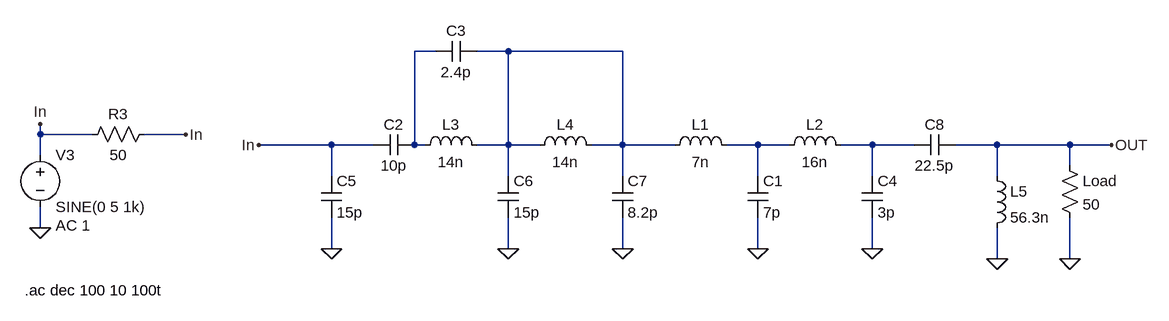
[diagram p0: schematic 433MHz filter with added low pass_and increased high pass.asc]
433MHz filter with added low pass_and increased high pass.asc, the LTspice schematic file:
Version 4
SHEET 1 2444 680
WIRE -944 16 -976 16
WIRE -832 16 -880 16
WIRE -656 16 -832 16
WIRE -1552 144 -1552 128
WIRE -1472 144 -1552 144
WIRE -1328 144 -1392 144
WIRE -1104 160 -1216 160
WIRE -1040 160 -1104 160
WIRE -976 160 -976 16
WIRE -960 160 -976 160
WIRE -832 160 -832 16
WIRE -832 160 -880 160
WIRE -784 160 -832 160
WIRE -656 160 -656 16
WIRE -656 160 -704 160
WIRE -576 160 -656 160
WIRE -448 160 -496 160
WIRE -400 160 -448 160
WIRE -272 160 -320 160
WIRE -208 160 -272 160
WIRE -80 160 -144 160
WIRE 32 160 -80 160
WIRE 96 160 32 160
WIRE -1552 176 -1552 144
WIRE 32 192 32 160
WIRE -1104 208 -1104 160
WIRE -832 208 -832 160
WIRE -656 208 -656 160
WIRE -448 208 -448 160
WIRE -272 208 -272 160
WIRE -80 208 -80 160
WIRE -1552 288 -1552 256
WIRE -1104 320 -1104 272
WIRE -832 320 -832 272
WIRE -656 320 -656 272
WIRE -448 320 -448 272
WIRE -272 320 -272 272
WIRE -80 336 -80 288
WIRE 32 336 32 272
FLAG -832 320 0
FLAG 32 336 0
FLAG -1552 288 0
FLAG -1552 128 In
FLAG -1328 144 In
FLAG 96 160 OUT
FLAG -272 320 0
FLAG -448 320 0
FLAG -80 336 0
FLAG -1216 160 In
FLAG -656 320 0
FLAG -1104 320 0
SYMBOL ind -976 176 R270
WINDOW 0 32 56 VTop 2
WINDOW 3 5 56 VBottom 2
SYMATTR InstName L3
SYMATTR Value 14n
SYMBOL ind -800 176 R270
WINDOW 0 32 56 VTop 2
WINDOW 3 5 56 VBottom 2
SYMATTR InstName L4
SYMATTR Value 14n
SYMBOL cap -1120 208 R0
SYMATTR InstName C5
SYMATTR Value 15p
SYMBOL cap -848 208 R0
SYMATTR InstName C6
SYMATTR Value 15p
SYMBOL cap -672 208 R0
SYMATTR InstName C7
SYMATTR Value 8.2p
SYMBOL cap -1040 176 R270
WINDOW 0 32 32 VTop 2
WINDOW 3 0 32 VBottom 2
SYMATTR InstName C2
SYMATTR Value 10p
SYMBOL cap -944 32 R270
WINDOW 0 32 32 VTop 2
WINDOW 3 0 32 VBottom 2
SYMATTR InstName C3
SYMATTR Value 2.4p
SYMBOL res 16 176 R0
SYMATTR InstName Load
SYMATTR Value 50
SYMBOL voltage -1552 160 R0
WINDOW 123 24 124 Left 2
WINDOW 39 0 0 Left 2
SYMATTR Value2 AC 1
SYMATTR InstName V3
SYMATTR Value SINE(0 5 1k)
SYMBOL res -1488 160 R270
WINDOW 0 32 56 VTop 2
WINDOW 3 0 56 VBottom 2
SYMATTR InstName R3
SYMATTR Value 50
SYMBOL ind -592 176 R270
WINDOW 0 32 56 VTop 2
WINDOW 3 5 56 VBottom 2
SYMATTR InstName L1
SYMATTR Value 7n
SYMBOL ind -416 176 R270
WINDOW 0 32 56 VTop 2
WINDOW 3 5 56 VBottom 2
SYMATTR InstName L2
SYMATTR Value 16n
SYMBOL cap -464 208 R0
SYMATTR InstName C1
SYMATTR Value 7p
SYMBOL cap -288 208 R0
SYMATTR InstName C4
SYMATTR Value 3p
SYMBOL cap -144 144 R90
WINDOW 0 0 32 VBottom 2
WINDOW 3 32 32 VTop 2
SYMATTR InstName C8
SYMATTR Value 22.5p
SYMBOL ind -96 192 R0
SYMATTR InstName L5
SYMATTR Value 56.3n
TEXT -1576 384 Left 2 !.ac dec 100 10 100t

The netlist it stands for:
* 433MHz filter with added low pass_and increased high pass.asc
L3 N001 N002 14n
L4 N002 N002 14n
C5 In 0 15p
C6 N002 0 15p
C7 N002 0 8.2p
C2 In N001 10p
C3 N001 N002 2.4p
R§Load OUT 0 50
V3 In 0 SINE(0 5 1k) AC 1
R3 In In 50
L1 N002 N003 7n
L2 N003 N004 16n
C1 N003 0 7p
C4 N004 0 3p
C8 OUT N004 22.5p
L5 OUT 0 56.3n
.ac dec 100 10 100t
.backanno
.end